# EasyEDA schematic Shield_V4_Connector_All.json
TITLE: Connector for Shield V4; REV: 1.0; Date: 2023-07-23; Sheet: 1/1; Company: Amir BS
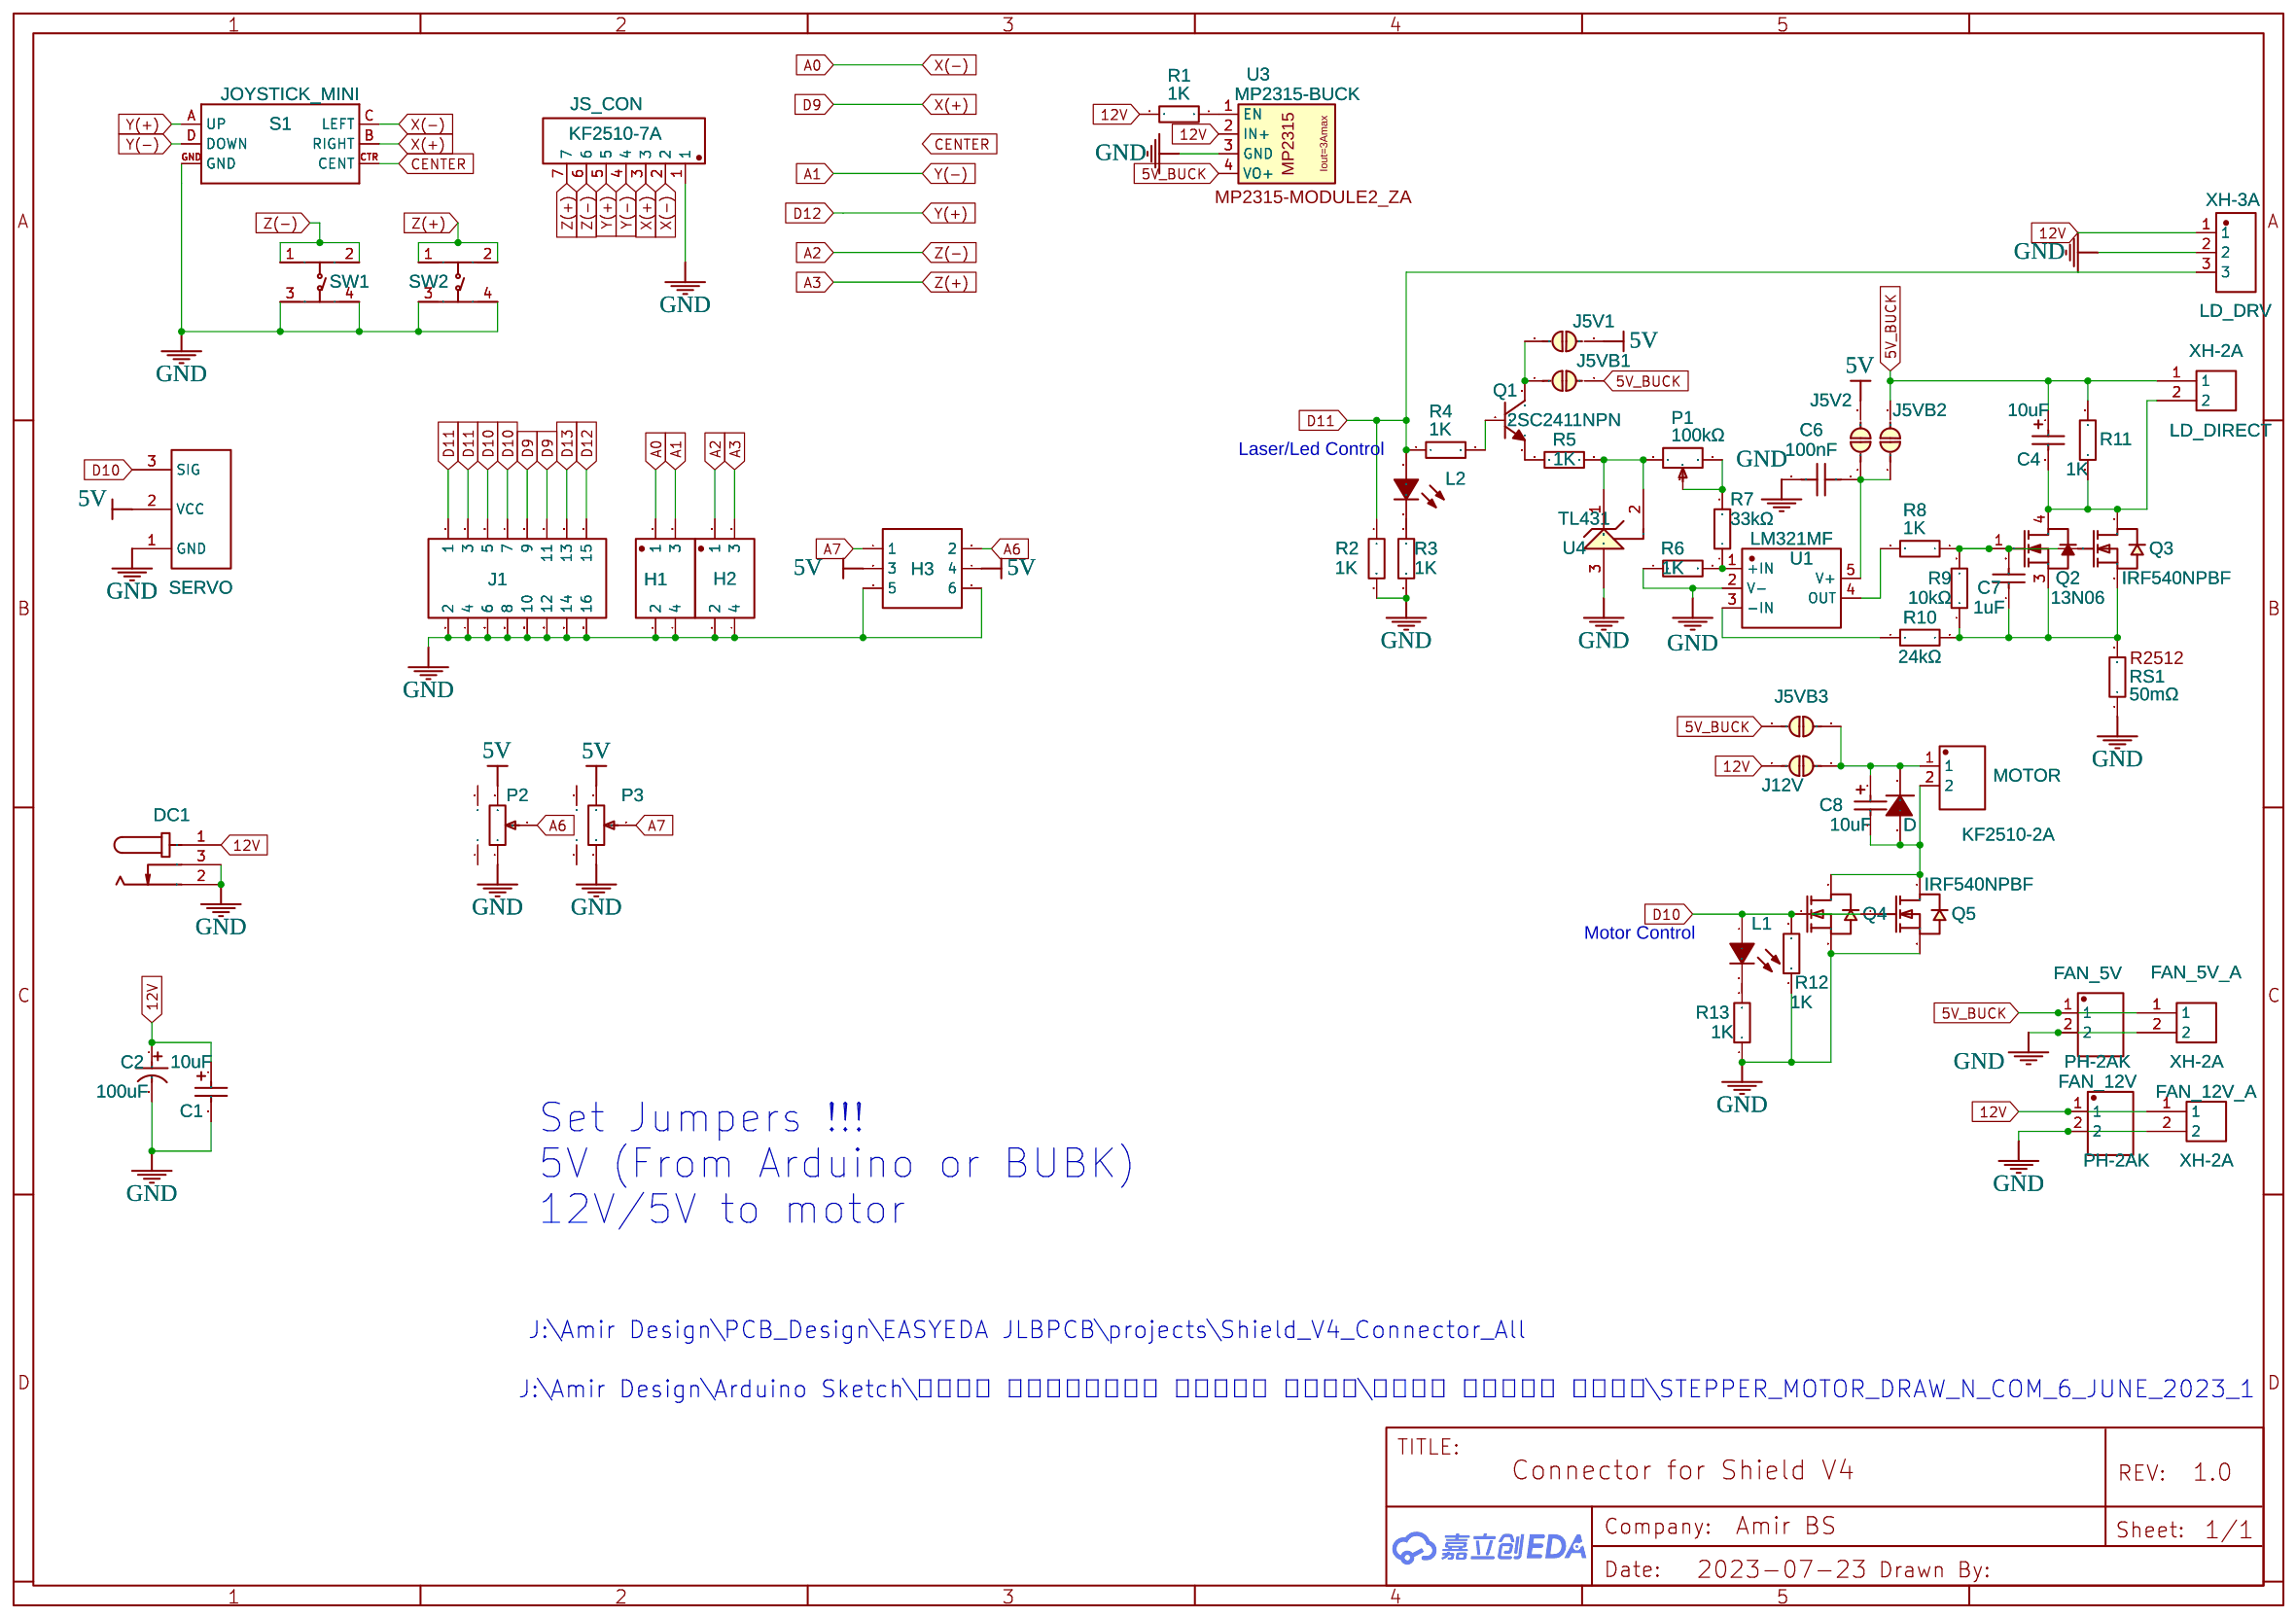
[diagram p0: schematic sheet]

## Parts
C1  10uF  [CAP-SMD_L3.2-W1.6-RD-C7171]
C2  100uF  [CAP-TH_BD6.3-P2.50-D1.0-FD]
C4  10uF  [CAP-SMD_L3.2-W1.6-RD-C7171]
C6  100nF  [C0603]
C7  1uF  [C0603]
C8  10uF  [CAP-SMD_L3.2-W1.6-RD-C7171]
D  1N4007  [SMAF_L3.5-W2.6-LS4.7-RD]
DC1  DC  [DC-IN-TH_DC005]
FAN_5V  PH-2AK  [CONN-TH_PH-2A]
FAN_5V_A  XH-2A  [CONN-TH_XH-2A]
FAN_12V  PH-2AK  [CONN-TH_PH-2A]
FAN_12V_A  XH-2A  [CONN-TH_XH-2A]
H1  Header-Female-2.54_2x2  [HDR-TH_4P-P2.54-V-F-R2-C2-S2.54]
H2  Header-Female-2.54_2x2  [HDR-TH_4P-P2.54-V-F-R2-C2-S2.54]
H3  Header-Female-2.54_2x3  [HDR-TH_6P-P2.54-V-F-R2-C3-S2.54]
J1  Header-Female-2.54_2x8  [HDR-TH_16P-P2.54-V-F-R2-C8-S2.54-1]
J5V1  JUMPER-SMT_2  [JUMPERS_SMT-JUMPER_2_NC_PASTE_NO-SILK]
J5V2  JUMPER-SMT_2  [JUMPERS_SMT-JUMPER_2_NC_PASTE_NO-SILK]
J5VB1  JUMPER-SMT_2  [JUMPERS_SMT-JUMPER_2_NC_PASTE_NO-SILK]
J5VB2  JUMPER-SMT_2  [JUMPERS_SMT-JUMPER_2_NC_PASTE_NO-SILK]
J5VB3  JUMPER-SMT_2  [JUMPERS_SMT-JUMPER_2_NC_PASTE_NO-SILK]
J12V  JUMPER-SMT_2  [JUMPERS_SMT-JUMPER_2_NC_PASTE_NO-SILK]
JS_CON  KF2510-7A  [CONN-TH_7P-P2.54_KF2510-7A]
L1  LED  [LED0603-R-RD_BLUE]
L2  LED  [LED0603-R-RD_BLUE]
LD_DIRECT  XH-2A  [CONN-TH_XH-2A]
LD_DRV  XH-3A  [CONN-TH_XH-3A]
MOTOR  KF2510-2A  [CONN-TH_KF2510-2A]
P1  100kΩ  [RES-ADJ-TH_3296W]
P2  长柄旋转电位器  [RES-ADJ-TH_RV09]
P3  长柄旋转电位器  [RES-ADJ-TH_RV09]
Q1  2SC2411NPN  [SOT-346_L2.9-W1.6-P1.90-LS2.8-TR-CW]
Q2  13N06  [DPAK_L6.5-W6.0-P2.29-LS9.9-BR]
Q3  IRF540NPBF  [TO-220-3_L10.0-W4.5-P2.54-L]
Q4  Q  [SOT-23-3_L2.9-W1.3-P1.90-LS2.4-BR]
Q5  IRF540NPBF  [TO-220-3_L10.0-W4.5-P2.54-L]
R1  1K  [R0603]
R2  1K  [R0603]
R3  1K  [R0603]
R4  1K  [R0603]
R5  1K  [R0603]
R6  1K  [R0603]
R7  33kΩ  [R0603]
R8  1K  [R0603]
R9  10kΩ  [R0603]
R10  24kΩ  [R0603]
R11  1K  [R0603]
R12  1K  [R0603]
R13  1K  [R0603]
RS1  50mΩ  [R2512]
S1  JOYSTICK_MINI  [JOYSTICK_MINI]
SERVO  Servo+3d  [SERVO+3D]
SW1  TC-6610-7-160G  [SW-TH_4P-L5.0-W5.0-P4.50-LS6.5]
SW2  TC-6610-7-160G  [SW-TH_4P-L5.0-W5.0-P4.50-LS6.5]
U1  LM321MF  [SOT-23-5_L2.9-W1.6-P0.95-LS2.8-BL]
U3  MP2315-BUCK  [MP2315-MODULE2_ZA]
U4  TL431  [SOT-23-3_L2.9-W1.3-P1.90-LS2.4-BR]

## Library data of the parts
C1 C4 C8 = TAJA106K016RNJ: Supplier: LCSC; Manufacturer: Kyocera AVX; Supplier Part: C7171; JLCPCB Part Class: Basic Part; Package Display: No
C2 = 100uF 35V 6.3*11: Supplier: LCSC; Manufacturer: CX(承兴); Supplier Part: C19504; JLCPCB Part Class: Extended Part; Package Display: No
C6 = CC0603KRX7R9BB104: Supplier: LCSC; Manufacturer: YAGEO(国巨); Supplier Part: C14663; JLCPCB Part Class: Basic Part; Package Display: No
C7 = CL10A105KB8NNNC: Supplier: LCSC; Manufacturer: SAMSUNG(三星); Supplier Part: C15849; JLCPCB Part Class: Basic Part; Package Display: No
D = 1N4007F: Supplier: LCSC; Manufacturer: SK; Supplier Part: C110856; JLCPCB Part Class: Extended Part; Package Display: No
DC1 = DC005-2.0MM: Supplier: LCSC; Manufacturer: SOFNG; Supplier Part: C111567; Package Display: No
FAN_5V FAN_12V = PH-2AK: Supplier: LCSC; Manufacturer: BOOMELE(博穆精密); Supplier Part: C8886; JLCPCB Part Class: Extended Part; Package Display: No
FAN_5V_A FAN_12V_A LD_DIRECT = XH-2A: JLCPCB Part Class: Extended Part; Package Display: No
H1 H2 = Header-Female-2.54_2x2: Supplier: LCSC; Manufacturer: CONNFLY; Manufacturer Part: DS1023-2*2SF11; Contributor: LCSC; Supplier Part: C92273; JLCPCB Part Class: Extended Part; Package Display: No
H3 = Header-Female-2.54_2x3: Supplier: LCSC; Manufacturer: CONNFLY; Manufacturer Part: DS1023-2*3SF11; Contributor: LCSC; Supplier Part: C92272; JLCPCB Part Class: Extended Part; Package Display: No
J1 = Header-Female-2.54_2x8: Supplier: LCSC; Manufacturer: BOOMELE(博穆精密); Manufacturer Part: 2.54-2*8P母; Supplier Part: C30734; JLCPCB Part Class: Extended Part; Package Display: No
J5V1 J5V2 J5VB1-J5VB3 J12V = JUMPER-SMT_2: Contributor: P-Thomsen; Package Display: No
JS_CON = KF2510-7A: Supplier: LCSC; Manufacturer: BOOMELE; Supplier Part: C35469; JLCPCB Part Class: Extended Part; Package Display: No
L1 L2 = 19-217/BHC-ZL1M2RY/3T: Supplier: LCSC; Manufacturer: EVERLIGHT; Supplier Part: C72041; JLCPCB Part Class: Basic Part; Package Display: No
LD_DRV = XH-3A_C2908601: Contributor: LCSC; JLCPCB Part Class: Extended Part; Package Display: No
MOTOR = KF2510-2A: Supplier: LCSC; Manufacturer: BOOMELE; Supplier Part: C27543; JLCPCB Part Class: Extended Part; Package Display: No
P1 = 3296W-1-104LF: Resistance(Ohms): 100K; JLCPCB Part Class: Extended Part; Package Display: No
P2 P3 = 长柄旋转电位器: Supplier: LCSC; Supplier Part: C2874842; Manufacturer: null; JLCPCB Part Class: Extended Part; Contributor: LCSC; Package Display: No
Q1 = 2SC2411KT146R: Contributor: LCSC; Supplier: LCSC; Supplier Part: C122622; Manufacturer: ROHM(罗姆); JLCPCB Part Class: Extended Part; Package Display: No
Q2 = FQD13N06LTM: Contributor: LCSC; Supplier: LCSC; Supplier Part: C236914; Manufacturer: onsemi(安森美); JLCPCB Part Class: Extended Part; Package Display: No
Q3 Q5 = IRF540NPBF: Supplier: LCSC; Manufacturer: Infineon(英飞凌); Supplier Part: C2566; JLCPCB Part Class: Extended Part; Package Display: No
Q4 = JSM2302: Supplier: LCSC; Supplier Part: C916403; Manufacturer: JSMSEMI; Contributor: LCSC; JLCPCB Part Class: Extended Part; Package Display: No
R1-R6 R8 R11-R13 = 0603WAF1001T5E: Supplier: LCSC; Manufacturer: UniOhm; Supplier Part: C21190; JLCPCB Part Class: Basic Part; Package Display: No
R7 = 0603WAF3302T5E: JLCPCB Part Class: Basic Part; Package Display: No
R9 = 0603WAF1002T5E: Supplier: LCSC; Manufacturer: UNI-ROYAL(厚声); Supplier Part: C25804; Resistance (Ohms): 10K; JLCPCB Part Class: Basic Part; Package Display: No
R10 = 0603WAF2402T5E: JLCPCB Part Class: Basic Part; Package Display: No
RS1 = CR2512F0R05E04: Contributor: LCSC; Supplier: LCSC; Supplier Part: C147122; Manufacturer: EVER OHMS(天二科技); JLCPCB Part Class: Extended Part; Package Display: Yes
S1 = JOYSTICK_MINI: Small 5-way tactile joystick, COM-10063; Contributor: SparkFun; Package Display: No
SERVO = Servo+3d: Manufacturer Part: New SchematicLib; Contributor: pjsg; Package Display: No
SW1 SW2 = TC-6610-7-160G: Contributor: LCSC; Supplier: LCSC; Supplier Part: C2845252; Manufacturer: HCTL(华灿天禄); JLCPCB Part Class: Extended Part; Package Display: No
U1 = LM321MF: Contributor: LCSC; Supplier: LCSC; Supplier Part: C668208; Manufacturer: UMW(广东友台半导体); JLCPCB Part Class: Extended Part; Package Display: No
U3 = MP2315-BUCK: Supplier: FatimaTech; Contributor: zainul.aabdin; Package Display: Yes
U4 = TL431BIDBZR: Supplier: LCSC; Manufacturer: TI(德州仪器); Supplier Part: C41283; JLCPCB Part Class: Extended Part; Package Display: No

## Nets
5V: H3.3 H3.4 J5V1.2 J5V2.2 P2.3 P3.3 SERVO.2(VCC)
5V_BUCK: C4.1 FAN_5V.1 FAN_5V_A.1 J5VB1.2 J5VB2.2 J5VB3.2 LD_DIRECT.1 R11.2 U3.4(VO+)
12V: C1.1 C2.1 DC1.1 FAN_12V.1 FAN_12V_A.1 J12V.2 LD_DRV.1 R1.2 U3.2(IN+)
GND: C1.2 C2.2 C6.2 DC1.2 DC1.3 FAN_5V.2 FAN_5V_A.2 FAN_12V.2 FAN_12V_A.2 H1.2 H1.4 H2.2 H2.4 H3.5 H3.6 J1.2 J1.4 J1.6 J1.8 J1.10 J1.12 J1.14 J1.16 JS_CON.1 LD_DRV.2 P2.1 P3.1 Q4.2(S) Q5.3(S) R2.2 R3.2 R6.1 R12.1 R13.1 RS1.1 S1.GND SERVO.1(GND) SW1.3 SW1.4 SW2.3 SW2.4 U1.2(V-) U3.3(GND) U4.3(ANODE)
A0: H1.1 JS_CON.2 S1.C(LEFT)
A1: H1.3 JS_CON.4 S1.D(DOWN)
A2: H2.1 JS_CON.6 SW1.1 SW1.2
A3: H2.3 JS_CON.7 SW2.1 SW2.2
A6: H3.2 P2.2
A7: H3.1 P3.2
CENTER: S1.CTR(CENT)
D9: J1.9 J1.11 JS_CON.3 S1.B(RIGHT)
D10: J1.5 J1.7 L1.1(A) Q4.1(G) Q5.1(G) R12.2 SERVO.3(SIG)
D11: J1.1 J1.3 L2.1(A) LD_DRV.3 R2.1 R4.1
D12: J1.15 JS_CON.5 S1.A(UP)
D13: J1.13
Net-(C4-2): C4.2 LD_DIRECT.2 Q2.4(D) Q3.2(D) R11.1
Net-(C6-1): C6.1 J5V2.1 J5VB2.1 U1.5(V+)
Net-(C7-1): C7.1 Q2.3(S) Q3.3(S) R9.1 R10.2 RS1.2
Net-(C7-2): C7.2 Q2.1(G) Q3.1(G) R8.1 R9.2
Net-(C8-1): C8.1 D.1(C) J5VB3.1 J12V.1 MOTOR.1
Net-(C8-2): C8.2 D.2(A) MOTOR.2 Q4.3(D) Q5.2(D)
Net-(J5V1-1): J5V1.1 J5VB1.1 Q1.3(C)
Net-(L1-2): L1.2(C) R13.2
Net-(L2-2): L2.2(C) R3.1
Net-(P1-1): P1.1 R5.1 U4.1(CATHODE) U4.2(REF)
Net-(P1-2): P1.2 P1.3 R7.2
Net-(Q1-1): Q1.1(E) R5.2
Net-(Q1-2): Q1.2(B) R4.2
Net-(R1-1): R1.1 U3.1(EN)
Net-(R6-2): R6.2 R7.1 U1.1(+IN)
Net-(R8-2): R8.2 U1.4(OUT)
Net-(R10-1): R10.1 U1.3(-IN)

Not connected (* = marked no-connect by the designer): P2 4 5; P3 4 5

## Notes on the sheet
- Laser/Led Control
- Motor Control
- Set Jumpers !!!
  5V (From Arduino or BUBK)
  12V/5V to motor
- J:\Amir Design\PCB_Design\EASYEDA JLBPCB\projects\Shield_V4_Connector_All
- J:\Amir Design\Arduino Sketch\קודי ארדווינו למנוע סטפר\בודק מנועי סטפר\STEPPER_MOTOR_DRAW_N_COM_6_JUNE_2023_1
